# EAGLE schematic untitled (EAGLE 6.1)
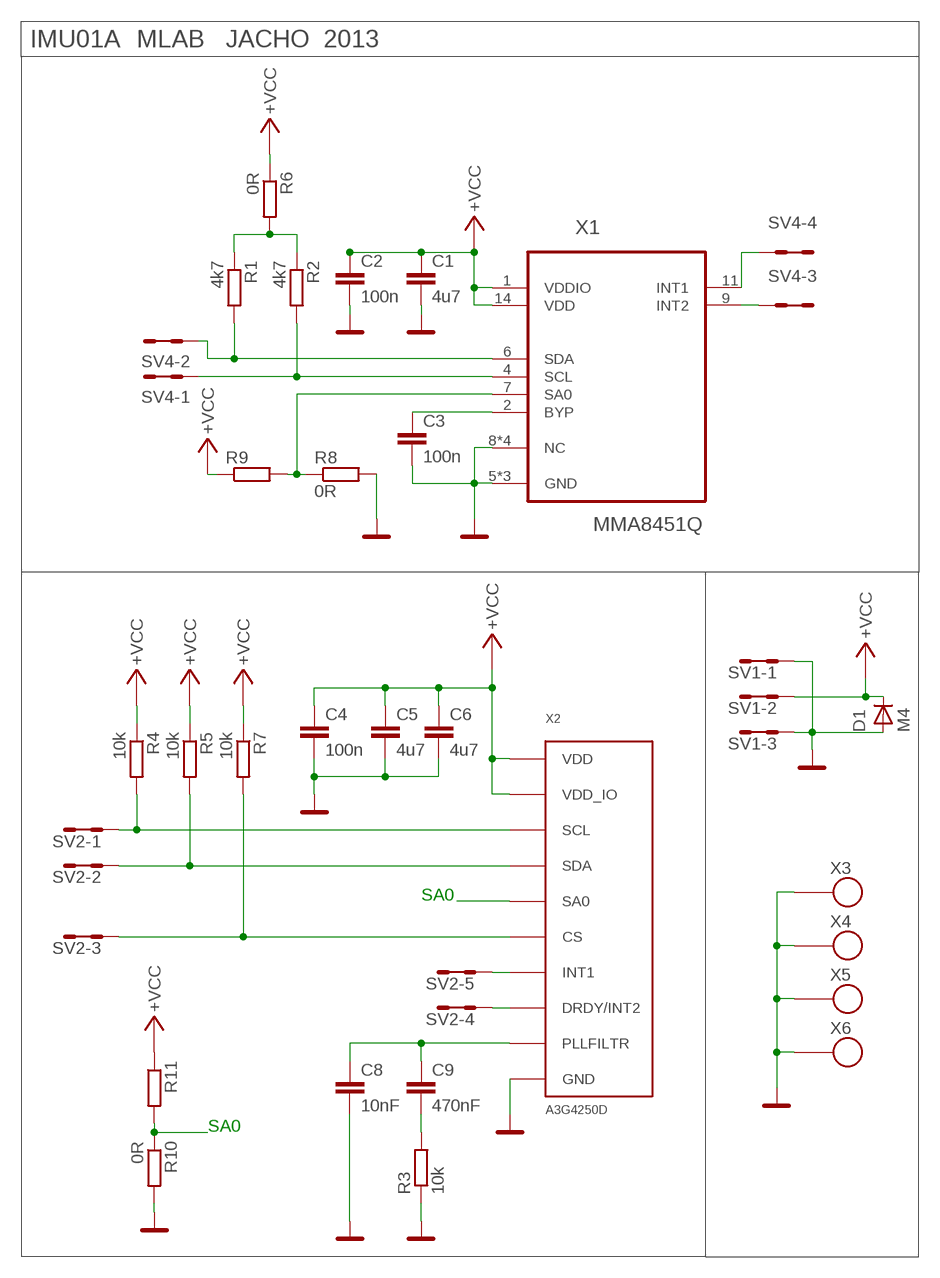
[diagram p0: schematic, sheet 1]

## Parts
C1  4u7  C-EUC0805  [C0805]
C2  100n  C-EUC0805  [C0805]
C3  100n  C-EUC0805  [C0805]
C4  100n  C-EUC0805  [C0805]
C5  4u7  C-EUC0805  [C0805]
C6  4u7  C-EUC0805  [C0805]
C8  10nF  C-EUC0805  [C0805]
C9  470nF  C-EUC0805  [C0805]
D1  M4  D-OB.SMA  [SMA]
R1  4k7  R-EU_R0805  [R0805]
R2  4k7  R-EU_R0805  [R0805]
R3  10k  R-EU_R0805  [R0805]
R4  10k  R-EU_R0805  [R0805]
R5  10k  R-EU_R0805  [R0805]
R6  0R  R-EU_R0805  [R0805]
R7  10k  R-EU_R0805  [R0805]
R8  0R  R0805  [0805]
R9  R-EU_R2010  [R2010]
R10  0R  R0805  [0805]
R11  R-EU_R2010  [R2010]
SV1  MA03-2  [MA03-2]
SV2  MA05-2  [MA05-2]
SV4  MA04-2  [MA04-2]
X1  MMA8451Q  [QFN50P300X300X100-16N]
X2  A3G4250D  A3G450D  [LGA16]
X3  SROUB3M  [SROUB3M]
X4  SROUB3M  [SROUB3M]
X5  SROUB3M  [SROUB3M]
X6  SROUB3M  [SROUB3M]

## Nets
+VCC: C1.1 C2.1 C4.1 C5.1 C6.1 D1.K(C) R4.1 R5.1 R6.1 R7.1 R9.1 R11.1 SV1.3 SV1.4 X1.1(VDDIO) X1.14(VDD) X2.1(VDD_IO) X2.15(VDD) X2.16(VDD)
GND: C1.2 C2.2 C3.2 C4.2 C5.2 C6.2 C8.2 D1.A R3.1 R8.2 R10.2 SV1.1 SV1.2 SV1.5 SV1.6 X1.5(GND) X1.8(NC) X1.10(GND) X1.12(GND) X1.13(NC) X1.15(NC) X1.16(NC) X2.8(GND) X2.9(GND) X2.10(GND) X2.11(GND) X2.12(GND) X2.13(GND) X3.P$1 X4.P$1 X5.P$1 X6.P$1
N$1: R1.2 SV4.3 SV4.4 X1.6(SDA)
N$2: R2.2 SV4.1 SV4.2 X1.4(SCL)
N$3: R8.1 R9.2 X1.7(SA0)
N$4: C8.1 C9.1 X2.14(PLLFILTR)
N$5: C3.1 X1.2(BYP)
N$7: R1.1 R2.1 R6.2
N$8: SV4.5 SV4.6 X1.9(INT2)
N$9: R7.2 SV2.5 SV2.6 X2.5(CS)
N$10: SV2.9 SV2.10 X2.7(INT1)
N$11: SV2.7 SV2.8 X2.6(DRDY/INT2)
N$12: SV4.7 SV4.8 X1.11(INT1)
N$14: R4.2 SV2.1 SV2.2 X2.2(SCL)
N$15: C9.2 R3.2
N$16: R5.2 SV2.3 SV2.4 X2.3(SDA)
SA0: R10.1 R11.2 X2.4(SA0)

## Notes on the sheet
- IMU01A | MLAB | JACHO | 2013
- SA0
- SA0

## Library data of the parts
C1-C6 C8 C9 = rcl:C-EU: CAPACITOR, European symbol
D1 = moje:D-OB.SMA: SMA
R1-R7 R9 R11 = rcl:R-EU_: RESISTOR, European symbol
R8 R10 = moje_R:R0805
SV1 = moje_hrebinky:MA03-2: PIN HEADER; OC_FARNELL: unknown; OC_NEWARK: unknown
SV2 = moje_hrebinky:MA05-2: PIN HEADER; OC_FARNELL: unknown; OC_NEWARK: unknown
SV4 = moje_hrebinky:MA04-2: PIN HEADER; OC_FARNELL: unknown; OC_NEWARK: unknown
X1 = moje_cidla:MMA8451Q
X2 = moje_cidla:A3G450D
X3-X6 = moje:SROUB3M